# EAGLE design 111_microphone (EAGLE 7.4.0)
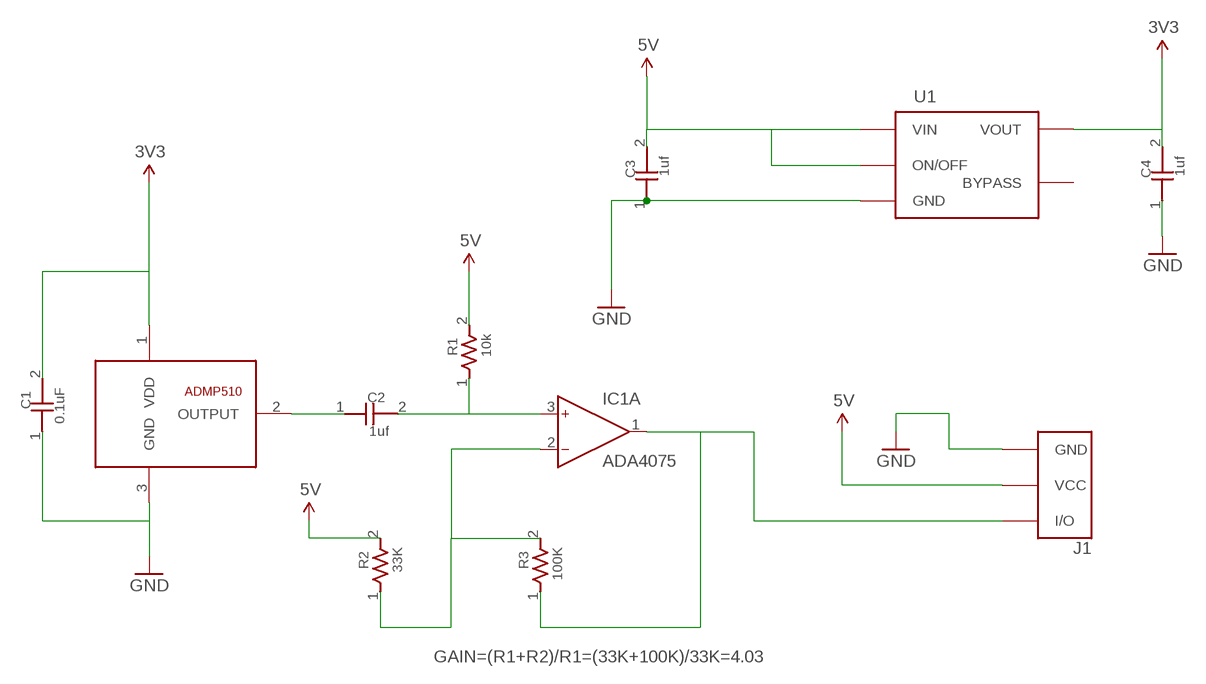
[diagram p0: schematic, sheet 1]

## Parts
C1  0.1uF  CAPACITOR0603  [0603]
C2  1uf  CAPACITOR0603  [0603]
C3  1uf  CAPACITOR0603  [0603]
C4  1uf  CAPACITOR0603  [0603]
IC1  ADA4075  ADA4075-2R  [SO8]
J1  FABO_BRICK_3PIN  [FABO_BRICK_3PIN]
R1  10k  RESISTOR0603  [0603]
R2  33K  RESISTOR0603  [0603]
R3  100K  RESISTOR0603  [0603]
U1  LP2985-33DBVR  [SOT_23_5]
U$1  ANALOGDEVICES-ADMP510  [ANALOGDEVICES-ADMP510]

## Nets
3V3: C1.2 C4.2 U1.5(VOUT) U$1.1(VDD)
5V: C3.2 J1.VCC R1.2 U1.1(VIN) U1.3(ON/OFF)
GND: C1.1 C3.1 C4.1 J1.GND U1.2(GND) U$1.3(GND)
N$1: C2.1 U$1.2(OUTPUT)
N$2: C2.2 IC1.3(A:IN+) R1.1
N$3: IC1.1(A:OUT) J1.IN/OUT(I/O) R3.1
N$4: IC1.2(A:IN-) R2.1
Unconnected: IC1.5(B:IN+) IC1.6(B:IN-) IC1.7(B:OUT) R2.2 R3.2 U1.4(BYPASS)

## Notes on the sheet
- GAIN=(R1+R2)/R1=(33K+100K)/33K=4.03

## Power pins joined to a net without a drawn wire
V+: IC1.8(P:V+)
V-: IC1.4(P:V-)

## Library data of the parts
C1 C2 = FaBo-Capacitor:CAPACITOR
C3 C4 = GClue-Capacitor:CAPACITOR
IC1 = analog-devices:ADA4075-2: Ultralow Noise Amplifier at Lower Power Source: http://www.analog.com/static/imported-files/data_sheets/ADA4075-2.pdf; MPN: ADA4075-2ARZ; OC_FARNELL: 1701254; OC_NEWARK: 19P8164
J1 = FaBo-Template:FABO_BRICK_3PIN: FaBo Brick 3pin
R1-R3 = FaBo-Resistors:RESISTOR
U1 = FaBo-Supply:LP2985: LP2985 IC REG LDO 3.3V 0.15 A
U$1 = FaBo-Mems:ANALOGDEVICES-ADMP510

## Board
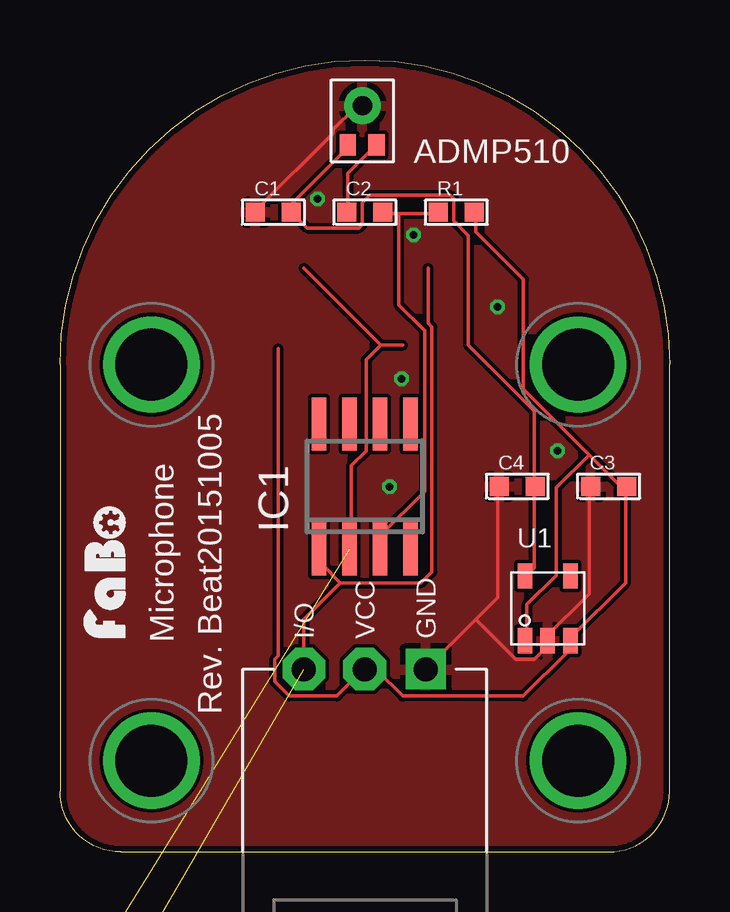
[diagram p1: board, top side]
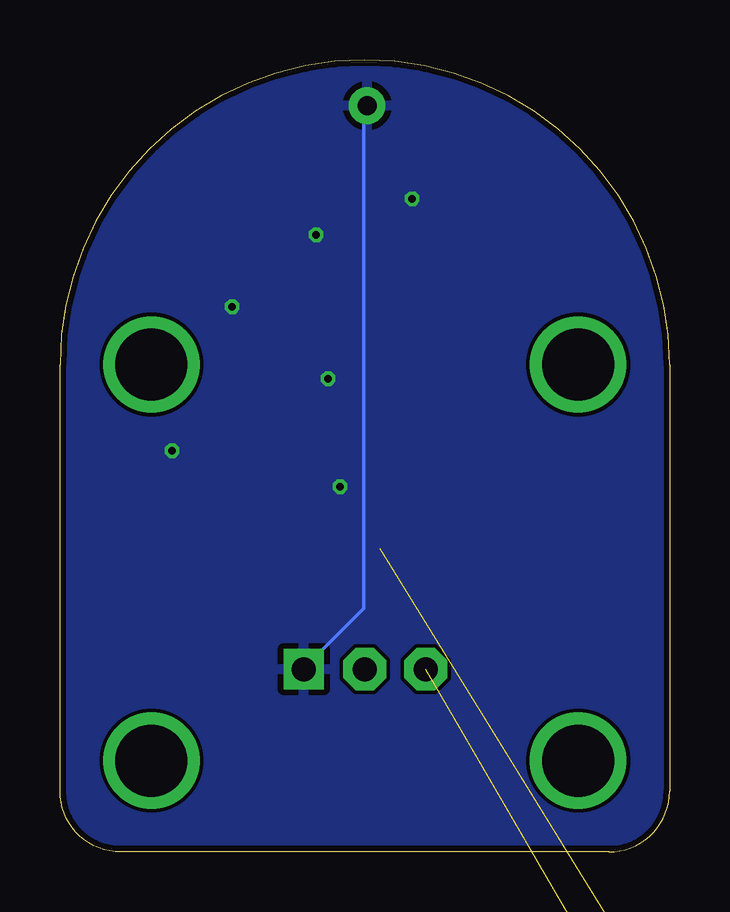
[diagram p2: board, bottom side, seen from below]

Size 25.4 x 33.02 mm. Coordinates in mm from the lower left corner, seen from the top.
Copper layers (1*16): Top 0.035mm / dielectric 1.5mm / Bottom 0.035mm
Design rules "SeeedStudio_2layer_DRU_no_angle_20140221": minimum track width 6mil, minimum drill 12mil, track to track 6mil, track to pad 6mil, pad to pad 6mil, via to via 6mil, smd to smd 0mil, copper to edge 10mil, drill to drill 10mil, minimum pad ring 10mil, minimum via ring 6mil, stop-mask expansion 2mil, vias tented up to drill 100mil, thermal gap 10mil

### Footprints (pad centres in the part's own frame; a part is rotated, then mirrored left to right if it is on the bottom)
0603 = smd 0.8 x 0.8: 1 -0.75,0; 2 0.75,0
SO8 = smd 0.6 x 2.2: 1 -1.905,-2.6; 2 -0.635,-2.6; 3 0.635,-2.6; 4 1.905,-2.6; 5 1.905,2.6; 6 0.635,2.6; 7 -0.635,2.6; 8 -1.905,2.6
FABO_BRICK_3PIN = drill 1 pad 1.676 square: GND 2.54,-8.89 | drill 1 pad 1.778 octagon: IN/OUT -2.54,-8.89; VCC 0,-8.89 | drill 3 pad 3.81: P$5 -8.89,3.81; P$6 8.89,3.81; P$7 -8.89,-12.7; P$8 8.89,-12.7
SOT_23_5 = smd 0.6 x 1.05: 1 -0.95,-1.35; 2 0,-1.35; 3 0.95,-1.35; 4 0.95,1.35; 5 -0.95,1.35
ANALOGDEVICES-ADMP510 = smd 0.9 x 0.68: 1 1,-0.61; 2 1,0.59 | drill 0.8 pad 1.524: 3 -0.635,0

### Placement (x,y rotation side)
C1  8.89,26.67 0 top
C2  12.7,26.67 0 top
C3  22.86,15.24 0 top
C4  19.05,15.24 0 top
IC1  12.7,15.24 0 top
J1  12.7,16.51 0 top
R1  16.51,26.67 0 top
R2  0.23,-7.77 0 top  (outside the outline)
R3  0.23,-10.77 0 top  (outside the outline)
U1  20.32,10.16 0 top
U$1  12.6,30.48 270 top
U$2  [LOGO_FABO_S]  2.73,11.73 90 top

### Tracks (layer width: path | path; a pad name or v marks a point on that pad's centre or on a via)
3V3
  Top 0.152: U1.5 19.46,11.53 19.76,11.84 19.76,15.19 C4.2 19.76,15.34 19.76,18.39 17.02,21.13 17.02,25.71 16.41,26.31 16.41,27.23 16.26,27.38 12.9,27.38 12.6,27.08 12.6,26.16 12.45,26.01 10.31,26.01 9.7,26.62 C1.2 9.7,26.77 9.7,27.08 11.99,29.36 U$1.1
5V
  Top 0.152: 9.09,20.98 9.09,8.18 8.94,8.03 8.94,7.11 9.55,6.5 11.53,6.5 12.6,7.57 J1.VCC 12.75,7.57 13.21,7.57 14.27,6.5 19.3,6.5 21.13,8.33 21.13,8.79 U1.3 21.28,8.94 23.57,11.23 23.57,15.04 | 23.57,15.04 23.57,15.19 C3.2 23.57,15.04 | 23.57,15.04 22.05,16.56 | 22.05,16.56 19.3,19.3 19.3,23.88 17.32,25.86 17.32,26.62 R1.2 | 22.05,16.56 20.68,15.19 20.68,11.53 19.46,10.31 19.46,8.94 U1.1
GND  (via drill 0.3)
  Top 0.152: C1.1 8.18,26.77 11.38,29.97 11.38,30.12 12.29,31.04 12.6,31.04 U$1.3 | C3.1 22.05,15.19 22.05,10.77 20.22,8.94 U1.2 20.22,8.79 20.22,8.48 19.76,8.03 19,8.03 17.32,9.7 | J1.GND 17.32,9.7 | 17.32,9.7 18.24,10.62 18.24,15.19 C4.1
  Bottom 0.152: U$1.3 12.75,31.04 12.75,10.16 15.19,7.72 J1.GND
  other vias: 18.23,22.73 14.23,19.73 13.73,15.23 20.73,16.73 10.73,27.23 14.73,25.73
  pour Top: -1.27,-1.27 26.73,-1.27 26.73,33.73 -1.27,33.73
  pour Bottom: -1.27,-1.27 26.73,-1.27 26.73,33.73 -1.27,33.73
N$1
  Top 0.152: C2.1 11.99,26.77 11.99,28.3 13.06,29.36 U$1.2
N$2
  Top 0.152: 14.12,26.62 15.65,26.62 R1.1 | 14.12,26.62 13.51,26.62 C2.2 | 14.12,26.62 14.12,22.81 15.19,21.74 15.19,15.04 13.36,13.21 13.36,12.75 IC1.3
N$3  (1 unrouted)
  Top 0.152: 15.34,24.33 15.34,22.05 15.49,21.89 15.49,11.68 15.04,11.23 11.68,11.23 | 11.68,11.23 10.92,11.99 10.92,12.6 IC1.1 | J1.IN/OUT 10.16,9.7 11.68,11.23
N$4  (1 unrouted)
  Top 0.152: 13.36,21.13 14.27,21.13 | 10.16,24.33 13.36,21.13 | 13.36,21.13 12.75,20.52 12.75,16.71 12.14,16.1 12.14,12.75 IC1.2

### Text on the board
tPlace: ADMP510 | Microphone | Rev. Beat20151005